# EAGLE design Kitty_PCB (EAGLE 9.2.2)
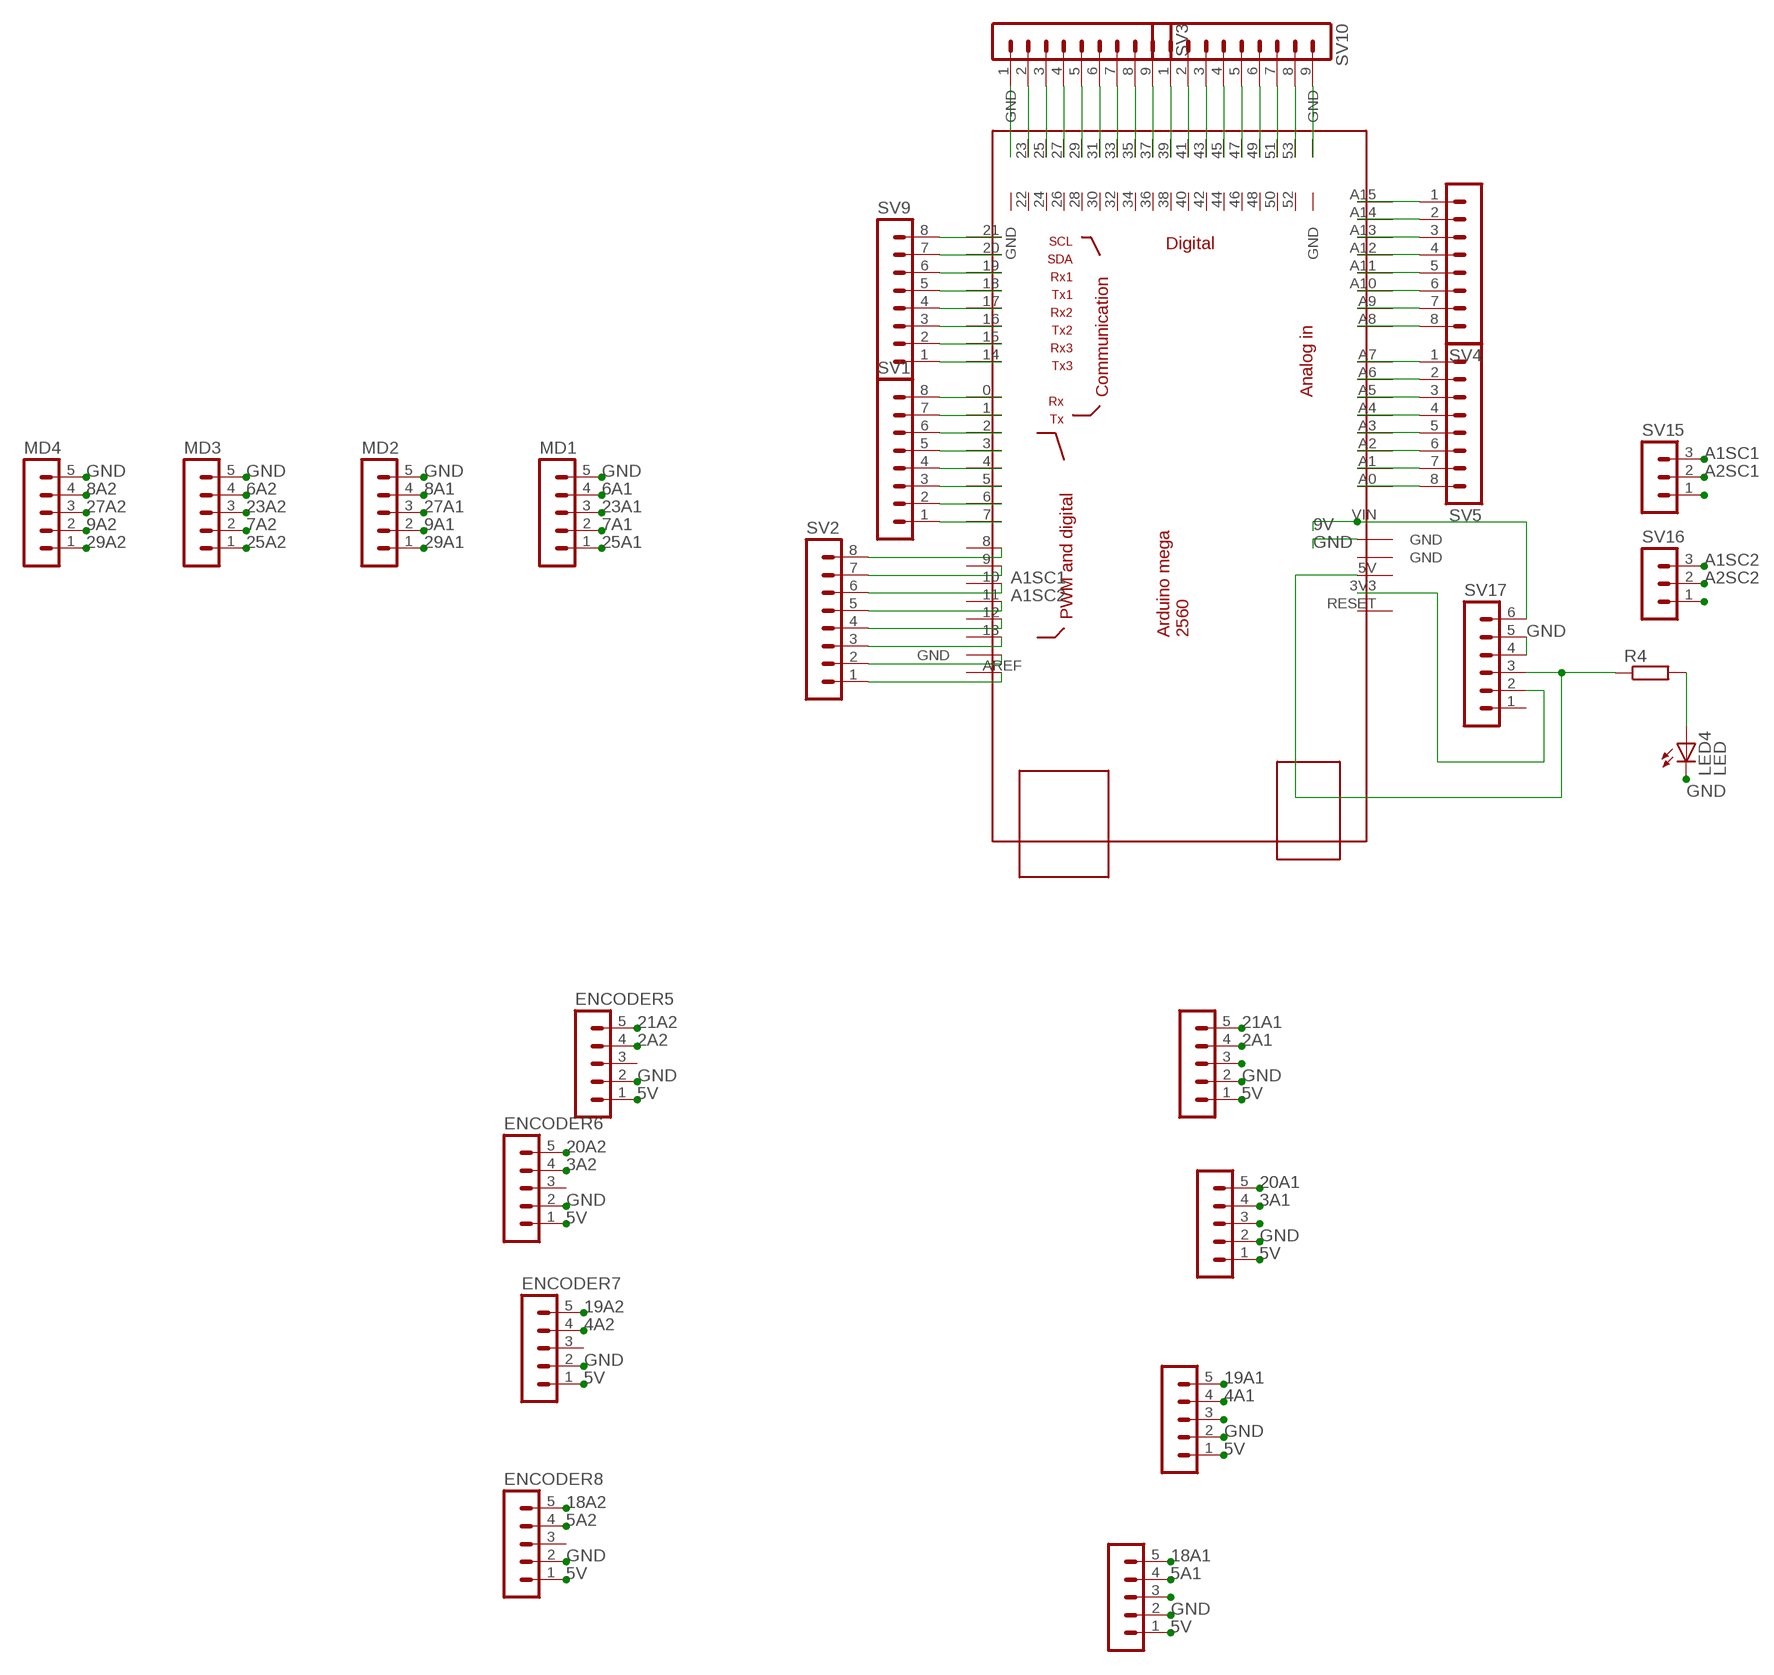
[diagram p0: schematic, sheet 1, part 1 of 2]
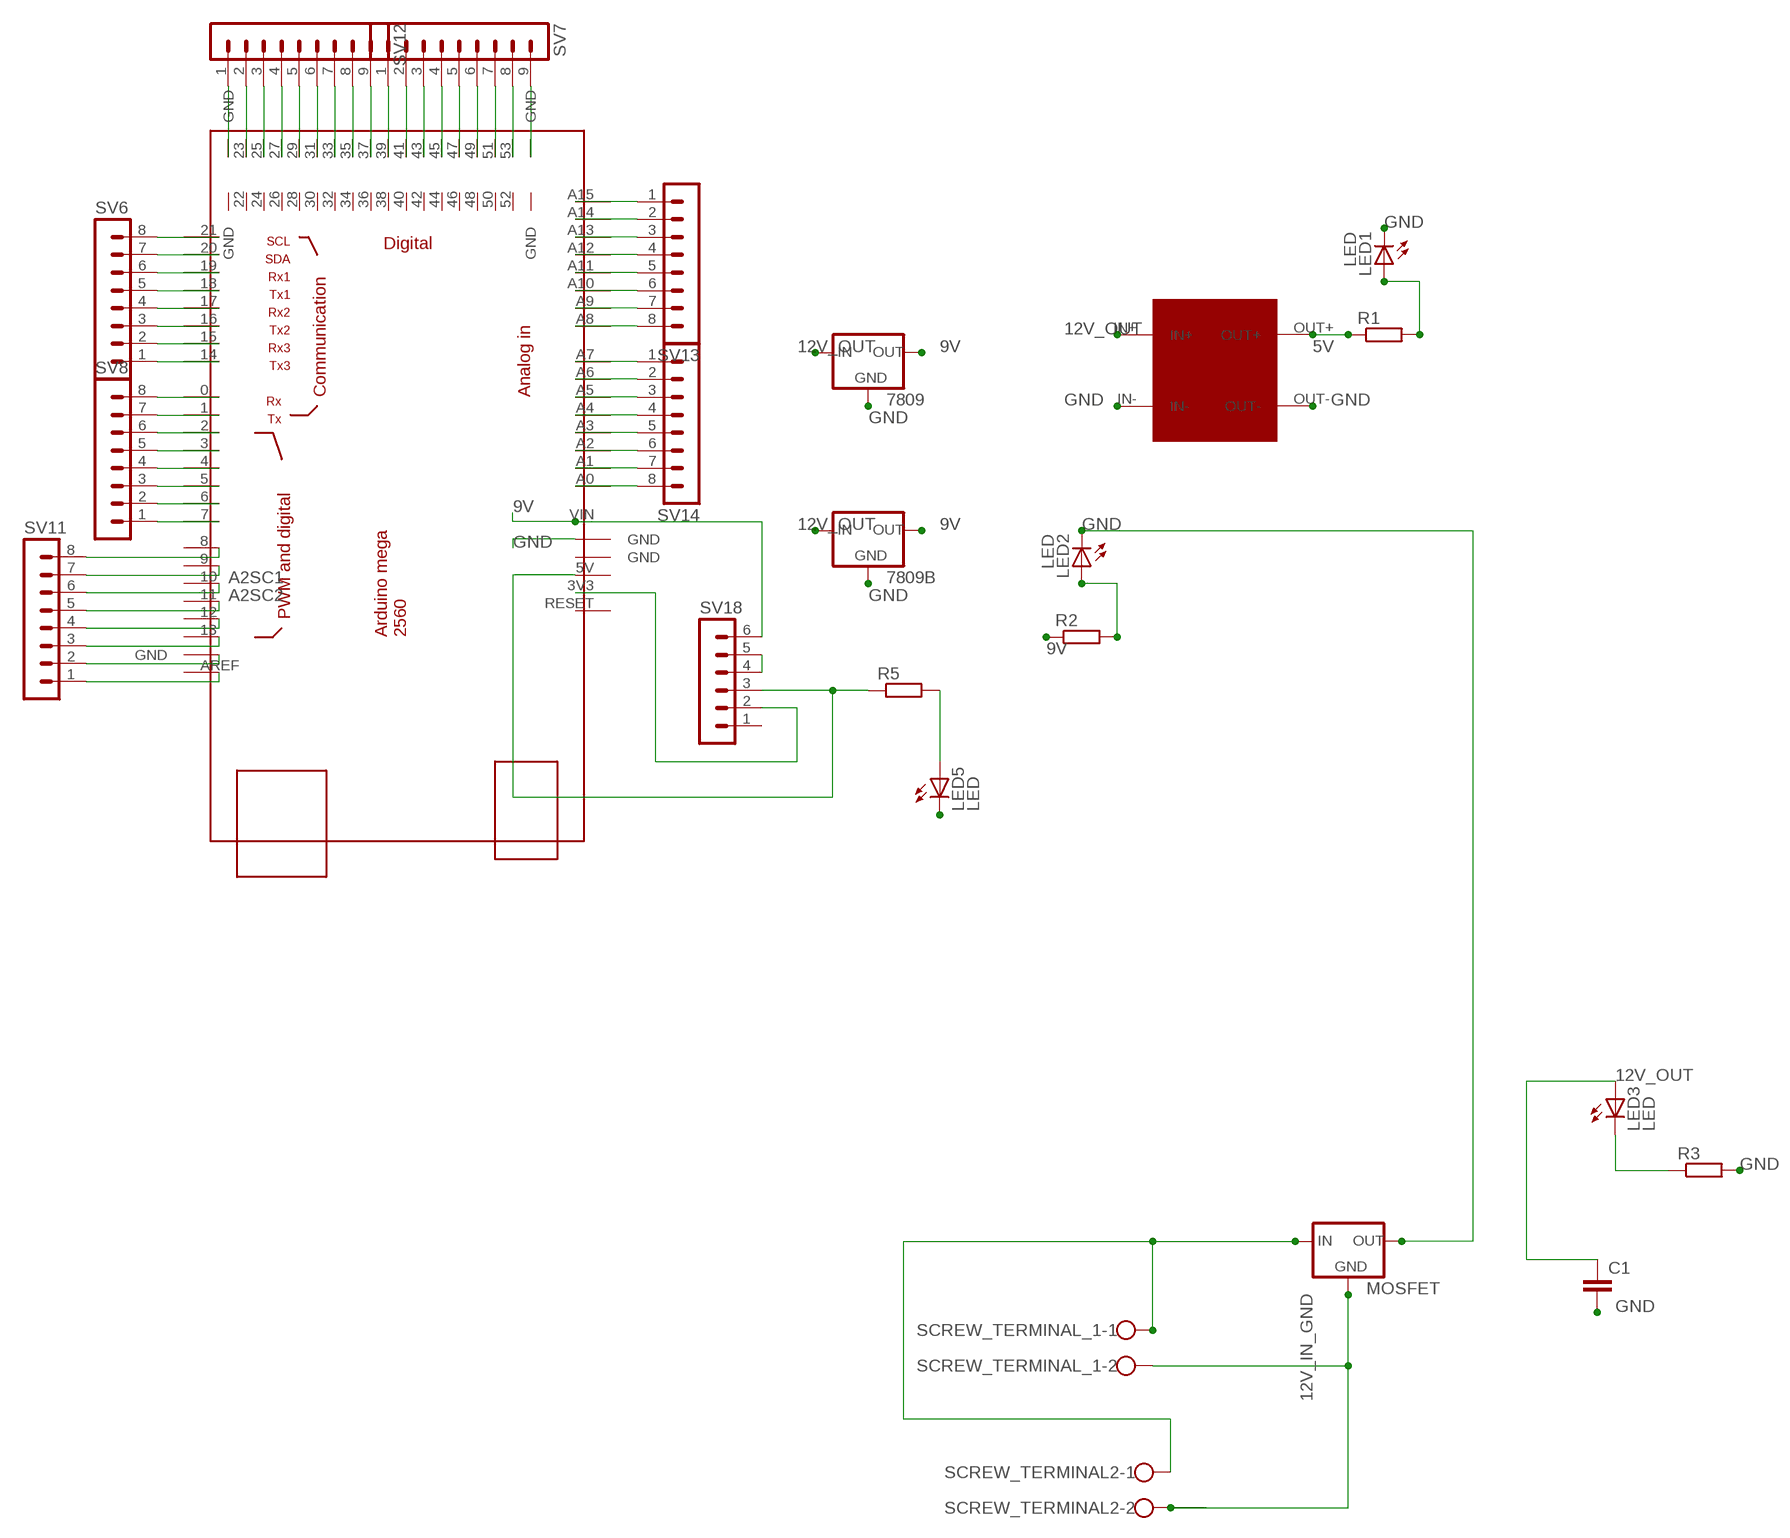
[diagram p1: schematic, sheet 1, part 2 of 2]

## Parts
7809  VOLTAGE_REGULATOR_78XXS  [78XXS]
7809B  VOLTAGE_REGULATOR_78XXS  [78XXS]
ARDUINO1  MEGA_DEVICE  [MEGABOX]
ARDUINO2  MEGA_DEVICE  [MEGABOX]
C1  CAPACITOR050-075X075  [C050-075X075]
ENCODER1  RELIMATE_05-1  [MA05-1]
ENCODER2  RELIMATE_05-1  [MA05-1]
ENCODER3  RELIMATE_05-1  [MA05-1]
ENCODER4  RELIMATE_05-1  [MA05-1]
ENCODER5  RELIMATE_05-1  [MA05-1]
ENCODER6  RELIMATE_05-1  [MA05-1]
ENCODER7  RELIMATE_05-1  [MA05-1]
ENCODER8  RELIMATE_05-1  [MA05-1]
LED1  LED  [LED3MM]
LED2  LED  [LED3MM]
LED3  LED  [LED3MM]
LED4  LED  [LED3MM]
LED5  LED  [LED3MM]
MD1  RELIMATE_05-1  [MA05-1]
MD2  RELIMATE_05-1  [MA05-1]
MD3  RELIMATE_05-1  [MA05-1]
MD4  RELIMATE_05-1  [MA05-1]
MOSFET  VOLTAGE_REGULATOR_78XXS  [78XXS]
R1  RESISTANCE0207/10  [0207/10]
R2  RESISTANCE0207/10  [0207/10]
R3  RESISTANCE0207/10  [0207/10]
R4  RESISTANCE0207/10  [0207/10]
R5  RESISTANCE0207/10  [0207/10]
SCREW_TERMINAL2  SCREW_TERMINAL_POWER  [POWER_CONNECTOR]
SCREW_TERMINAL_1  SCREW_TERMINAL_POWER  [POWER_CONNECTOR]
SV1  RELIMATE_08-1  [MA08-1]
SV2  RELIMATE_08-1  [MA08-1]
SV3  RELIMATE_09-1  [MA09-1]
SV4  RELIMATE_08-1  [MA08-1]
SV5  RELIMATE_08-1  [MA08-1]
SV6  RELIMATE_08-1  [MA08-1]
SV7  RELIMATE_09-1  [MA09-1]
SV8  RELIMATE_08-1  [MA08-1]
SV9  RELIMATE_08-1  [MA08-1]
SV10  RELIMATE_09-1  [MA09-1]
SV11  RELIMATE_08-1  [MA08-1]
SV12  RELIMATE_09-1  [MA09-1]
SV13  RELIMATE_08-1  [MA08-1]
SV14  RELIMATE_08-1  [MA08-1]
SV15  RELIMATE_03-1  [MA03-1]
SV16  RELIMATE_03-1  [MA03-1]
SV17  RELIMATE_06-1  [MA06-1]
SV18  RELIMATE_06-1  [MA06-1]
U$1  BUCK_CONVERTER  [BUCK_CONVERTER]

## Nets
0A1: ARDUINO1.0 SV1.8
0A2: ARDUINO2.0 SV8.8
1A1: ARDUINO1.1 SV1.7
1A2: ARDUINO2.1 SV8.7
2A1: ARDUINO1.2 ENCODER1.4 SV1.6
2A2: ARDUINO2.2 ENCODER5.4 SV8.6
3A1: ARDUINO1.3 ENCODER2.4 SV1.5
3A2: ARDUINO2.3 ENCODER6.4 SV8.5
4A1: ARDUINO1.4 ENCODER3.4 SV1.4
4A2: ARDUINO2.4 ENCODER7.4 SV8.4
5A1: ARDUINO1.5 ENCODER4.4 SV1.3
5A2: ARDUINO2.5 ENCODER8.4 SV8.3
5V: ENCODER1.1 ENCODER2.1 ENCODER3.1 ENCODER4.1 ENCODER5.1 ENCODER6.1 ENCODER7.1 ENCODER8.1 R1.1 U$1.OUT+
6A1: ARDUINO1.6 MD1.4 SV1.2
6A2: ARDUINO2.6 MD3.4 SV8.2
7A1: ARDUINO1.7 MD1.2 SV1.1
7A2: ARDUINO2.7 MD3.2 SV8.1
8A1: ARDUINO1.8 MD2.4 SV2.8
8A2: ARDUINO2.8 MD4.4 SV11.8
9A1: MD2.2
9A2: ARDUINO1.9 ARDUINO2.9 MD4.2 SV2.7 SV11.7
9V: 7809.OUT 7809B.OUT ARDUINO1.VIN ARDUINO2.VIN R2.1 SV17.6 SV18.6
12A1: ARDUINO1.12 SV2.4
12A2: ARDUINO2.12 SV11.4
12V_IN_GND: MOSFET.GND SCREW_TERMINAL2.2 SCREW_TERMINAL_1.2
12V_OUT: 7809.IN 7809B.IN C1.1 LED3.A MOSFET.IN SCREW_TERMINAL2.1 SCREW_TERMINAL_1.1 U$1.IN+
13A1: ARDUINO1.13 SV2.3
13A2: ARDUINO2.13 SV11.3
14A1: ARDUINO1.14 SV9.1
14A2: ARDUINO2.14 SV6.1
15A1: ARDUINO1.15 SV9.2
15A2: ARDUINO2.15 SV6.2
16A1: ARDUINO1.16 SV9.3
16A2: ARDUINO2.16 SV6.3
17A1: ARDUINO1.17 SV9.4
17A2: ARDUINO2.17 SV6.4
18A1: ARDUINO1.18 ENCODER4.5 SV9.5
18A2: ARDUINO2.18 ENCODER8.5 SV6.5
19A1: ARDUINO1.19 ENCODER3.5 SV9.6
19A2: ARDUINO2.19 ENCODER7.5 SV6.6
20A1: ARDUINO1.20 ENCODER2.5 SV9.7
20A2: ARDUINO2.20 ENCODER6.5 SV6.7
21A1: ARDUINO1.21 ENCODER1.5 SV9.8
21A2: ARDUINO2.21 ENCODER5.5 SV6.8
23A1: ARDUINO1.23 MD1.3 SV3.2
23A2: ARDUINO2.23 MD3.3 SV12.2
25A1: ARDUINO1.25 MD1.1 SV3.3
25A2: ARDUINO2.25 MD3.1 SV12.3
27A1: ARDUINO1.27 MD2.3 SV3.4
27A2: ARDUINO2.27 MD4.3 SV12.4
29A1: ARDUINO1.29 MD2.1 SV3.5
29A2: ARDUINO2.29 MD4.1 SV12.5
31A1: ARDUINO1.31 SV3.6
31A2: ARDUINO2.31 SV12.6
33A1: ARDUINO1.33 SV3.7
33A2: ARDUINO2.33 SV12.7
35A1: ARDUINO1.35 SV3.8
35A2: ARDUINO2.35 SV12.8
37A1: ARDUINO1.37 SV3.9
37A2: ARDUINO2.37 SV12.9
A1SC1: ARDUINO1.10 SV2.6 SV15.3
A1SC2: ARDUINO1.11 SV2.5 SV16.3
A2SC1: ARDUINO2.10 SV11.6 SV15.2
A2SC2: ARDUINO2.11 SV11.5 SV16.2
GND: 7809.GND 7809B.GND ARDUINO1.GND@3(GND) ARDUINO2.GND@3(GND) C1.2 ENCODER1.2 ENCODER2.2 ENCODER3.2 ENCODER4.2 ENCODER5.2 ENCODER6.2 ENCODER7.2 ENCODER8.2 LED1.K(C) LED2.K(C) LED4.K(C) LED5.A LED5.K(C) MD1.5 MD2.5 MD3.5 MD4.5 MOSFET.OUT R3.2 R5.2 SV17.4 SV17.5 U$1.IN- U$1.OUT-
N$1: ARDUINO1.3V3 SV17.2
N$2: ARDUINO1.5V R4.1 SV17.3
N$3: LED1.A R1.2
N$4: SV18.4 SV18.5
N$5: ARDUINO2.3V3 SV18.2
N$6: ARDUINO2.5V R5.1 SV18.3
N$7: LED4.A R4.2
N$19: LED2.A R2.2
N$20: ARDUINO1.GND@5(GND) SV3.1
N$24: ARDUINO1.GND@1(GND) SV2.2
N$25: ARDUINO1.AREF SV2.1
N$26: ARDUINO1.A15 SV4.1
N$27: ARDUINO1.A14 SV4.2
N$28: ARDUINO1.A13 SV4.3
N$29: ARDUINO1.A12 SV4.4
N$30: ARDUINO1.A11 SV4.5
N$31: ARDUINO1.A10 SV4.6
N$32: ARDUINO1.A9 SV4.7
N$33: ARDUINO1.A8 SV4.8
N$34: ARDUINO1.A7 SV5.1
N$35: ARDUINO1.A6 SV5.2
N$36: ARDUINO1.A5 SV5.3
N$37: ARDUINO1.A4 SV5.4
N$38: ARDUINO1.A3 SV5.5
N$39: ARDUINO1.A2 SV5.6
N$40: ARDUINO1.A1 SV5.7
N$41: ARDUINO1.A0 SV5.8
N$59: SV15.1
N$64: ARDUINO2.GND@1(GND) SV11.2
N$65: ARDUINO2.AREF SV11.1
N$66: ARDUINO2.A15 SV13.1
N$67: ARDUINO2.A14 SV13.2
N$68: ARDUINO2.A13 SV13.3
N$69: ARDUINO2.A12 SV13.4
N$70: ARDUINO2.A11 SV13.5
N$71: ARDUINO2.A10 SV13.6
N$72: ARDUINO2.A9 SV13.7
N$73: ARDUINO2.A8 SV13.8
N$74: ARDUINO2.A7 SV14.1
N$75: ARDUINO2.A6 SV14.2
N$76: ARDUINO2.A5 SV14.3
N$77: ARDUINO2.A4 SV14.4
N$78: ARDUINO2.A3 SV14.5
N$79: ARDUINO2.A2 SV14.6
N$80: ARDUINO2.A1 SV14.7
N$81: ARDUINO2.A0 SV14.8
N$82: SV16.1
N$88: ARDUINO1.39 SV10.1
N$89: ARDUINO1.41 SV10.2
N$90: ARDUINO1.43 SV10.3
N$91: ARDUINO1.45 SV10.4
N$92: ARDUINO1.47 SV10.5
N$93: ARDUINO1.49 SV10.6
N$94: ARDUINO1.51 SV10.7
N$95: ARDUINO1.53 SV10.8
N$96: ARDUINO1.GND@7(GND) SV10.9
N$97: ARDUINO2.GND@5(GND) SV12.1
N$106: ARDUINO2.39 SV7.1
N$107: ARDUINO2.41 SV7.2
N$108: ARDUINO2.43 SV7.3
N$109: ARDUINO2.45 SV7.4
N$110: ARDUINO2.47 SV7.5
N$111: ARDUINO2.49 SV7.6
N$112: ARDUINO2.51 SV7.7
N$113: ARDUINO2.53 SV7.8
N$114: ARDUINO2.GND@7(GND) SV7.9
N$115: LED3.K(C) R3.1
N$118: ENCODER1.3
N$122: ENCODER2.3
N$126: ENCODER4.3
N$130: ENCODER3.3
Unconnected: ARDUINO1.22 ARDUINO1.24 ARDUINO1.26 ARDUINO1.28 ARDUINO1.30 ARDUINO1.32 ARDUINO1.34 ARDUINO1.36 ARDUINO1.38 ARDUINO1.40 ARDUINO1.42 ARDUINO1.44 ARDUINO1.46 ARDUINO1.48 ARDUINO1.50 ARDUINO1.52 ARDUINO1.GND@2(GND) ARDUINO1.GND@4(GND) ARDUINO1.GND@6(GND) ARDUINO1.RESET ARDUINO2.22 ARDUINO2.24 ARDUINO2.26 ARDUINO2.28 ARDUINO2.30 ARDUINO2.32 ARDUINO2.34 ARDUINO2.36 ARDUINO2.38 ARDUINO2.40 ARDUINO2.42 ARDUINO2.44 ARDUINO2.46 ARDUINO2.48 ARDUINO2.50 ARDUINO2.52 ARDUINO2.GND@2(GND) ARDUINO2.GND@4(GND) ARDUINO2.GND@6(GND) ARDUINO2.RESET ENCODER5.3 ENCODER6.3 ENCODER7.3 ENCODER8.3 SV17.1 SV18.1

## Library data of the parts
7809 7809B MOSFET = robocon:VOLTAGE_REGULATOR_78XXS: VOLTAGE REGULATOR
ARDUINO1 ARDUINO2 = ArduinoMegaSymbol:MEGA_DEVICE: mega card as device
C1 = robocon:CAPACITOR: CAPACITOR, European symbol
ENCODER1-ENCODER8 MD1-MD4 = robocon:RELIMATE_05-1: PIN HEADER; OC_FARNELL: unknown; OC_NEWARK: unknown
LED1-LED5 = robocon:LED: Low Current (2mA) LED 3 mm Tinted Diffused Package color RED Source: Data sheet <http://www.farnell.com/datasheets/391100.pdf>; MF: VISHAY SEMICONDUCTOR; OC_FARNELL: 1612437
R1-R5 = robocon:RESISTANCE: RESISTOR, European symbol
SCREW_TERMINAL2 SCREW_TERMINAL_1 = robocon:SCREW_TERMINAL_POWER: WAGO SCREW CLAMP; MPN: 237-102; OC_FARNELL: unknown; OC_NEWARK: 70K9898
SV1 SV2 SV4-SV6 SV8 SV9 SV11 SV13 SV14 = robocon:RELIMATE_08-1: PIN HEADER; OC_FARNELL: unknown; OC_NEWARK: unknown
SV3 SV7 SV10 SV12 = robocon:RELIMATE_09-1: PIN HEADER; OC_FARNELL: unknown; OC_NEWARK: unknown
SV15 SV16 = robocon:RELIMATE_03-1: PIN HEADER; OC_FARNELL: unknown; OC_NEWARK: unknown
SV17 SV18 = robocon:RELIMATE_06-1: PIN HEADER; OC_FARNELL: unknown; OC_NEWARK: unknown
U$1 = robocon:BUCK_CONVERTER: LM2596-DC-DC-buck-converter-adjustable-3V-40V-step-down-module-power-supply LM

## Board
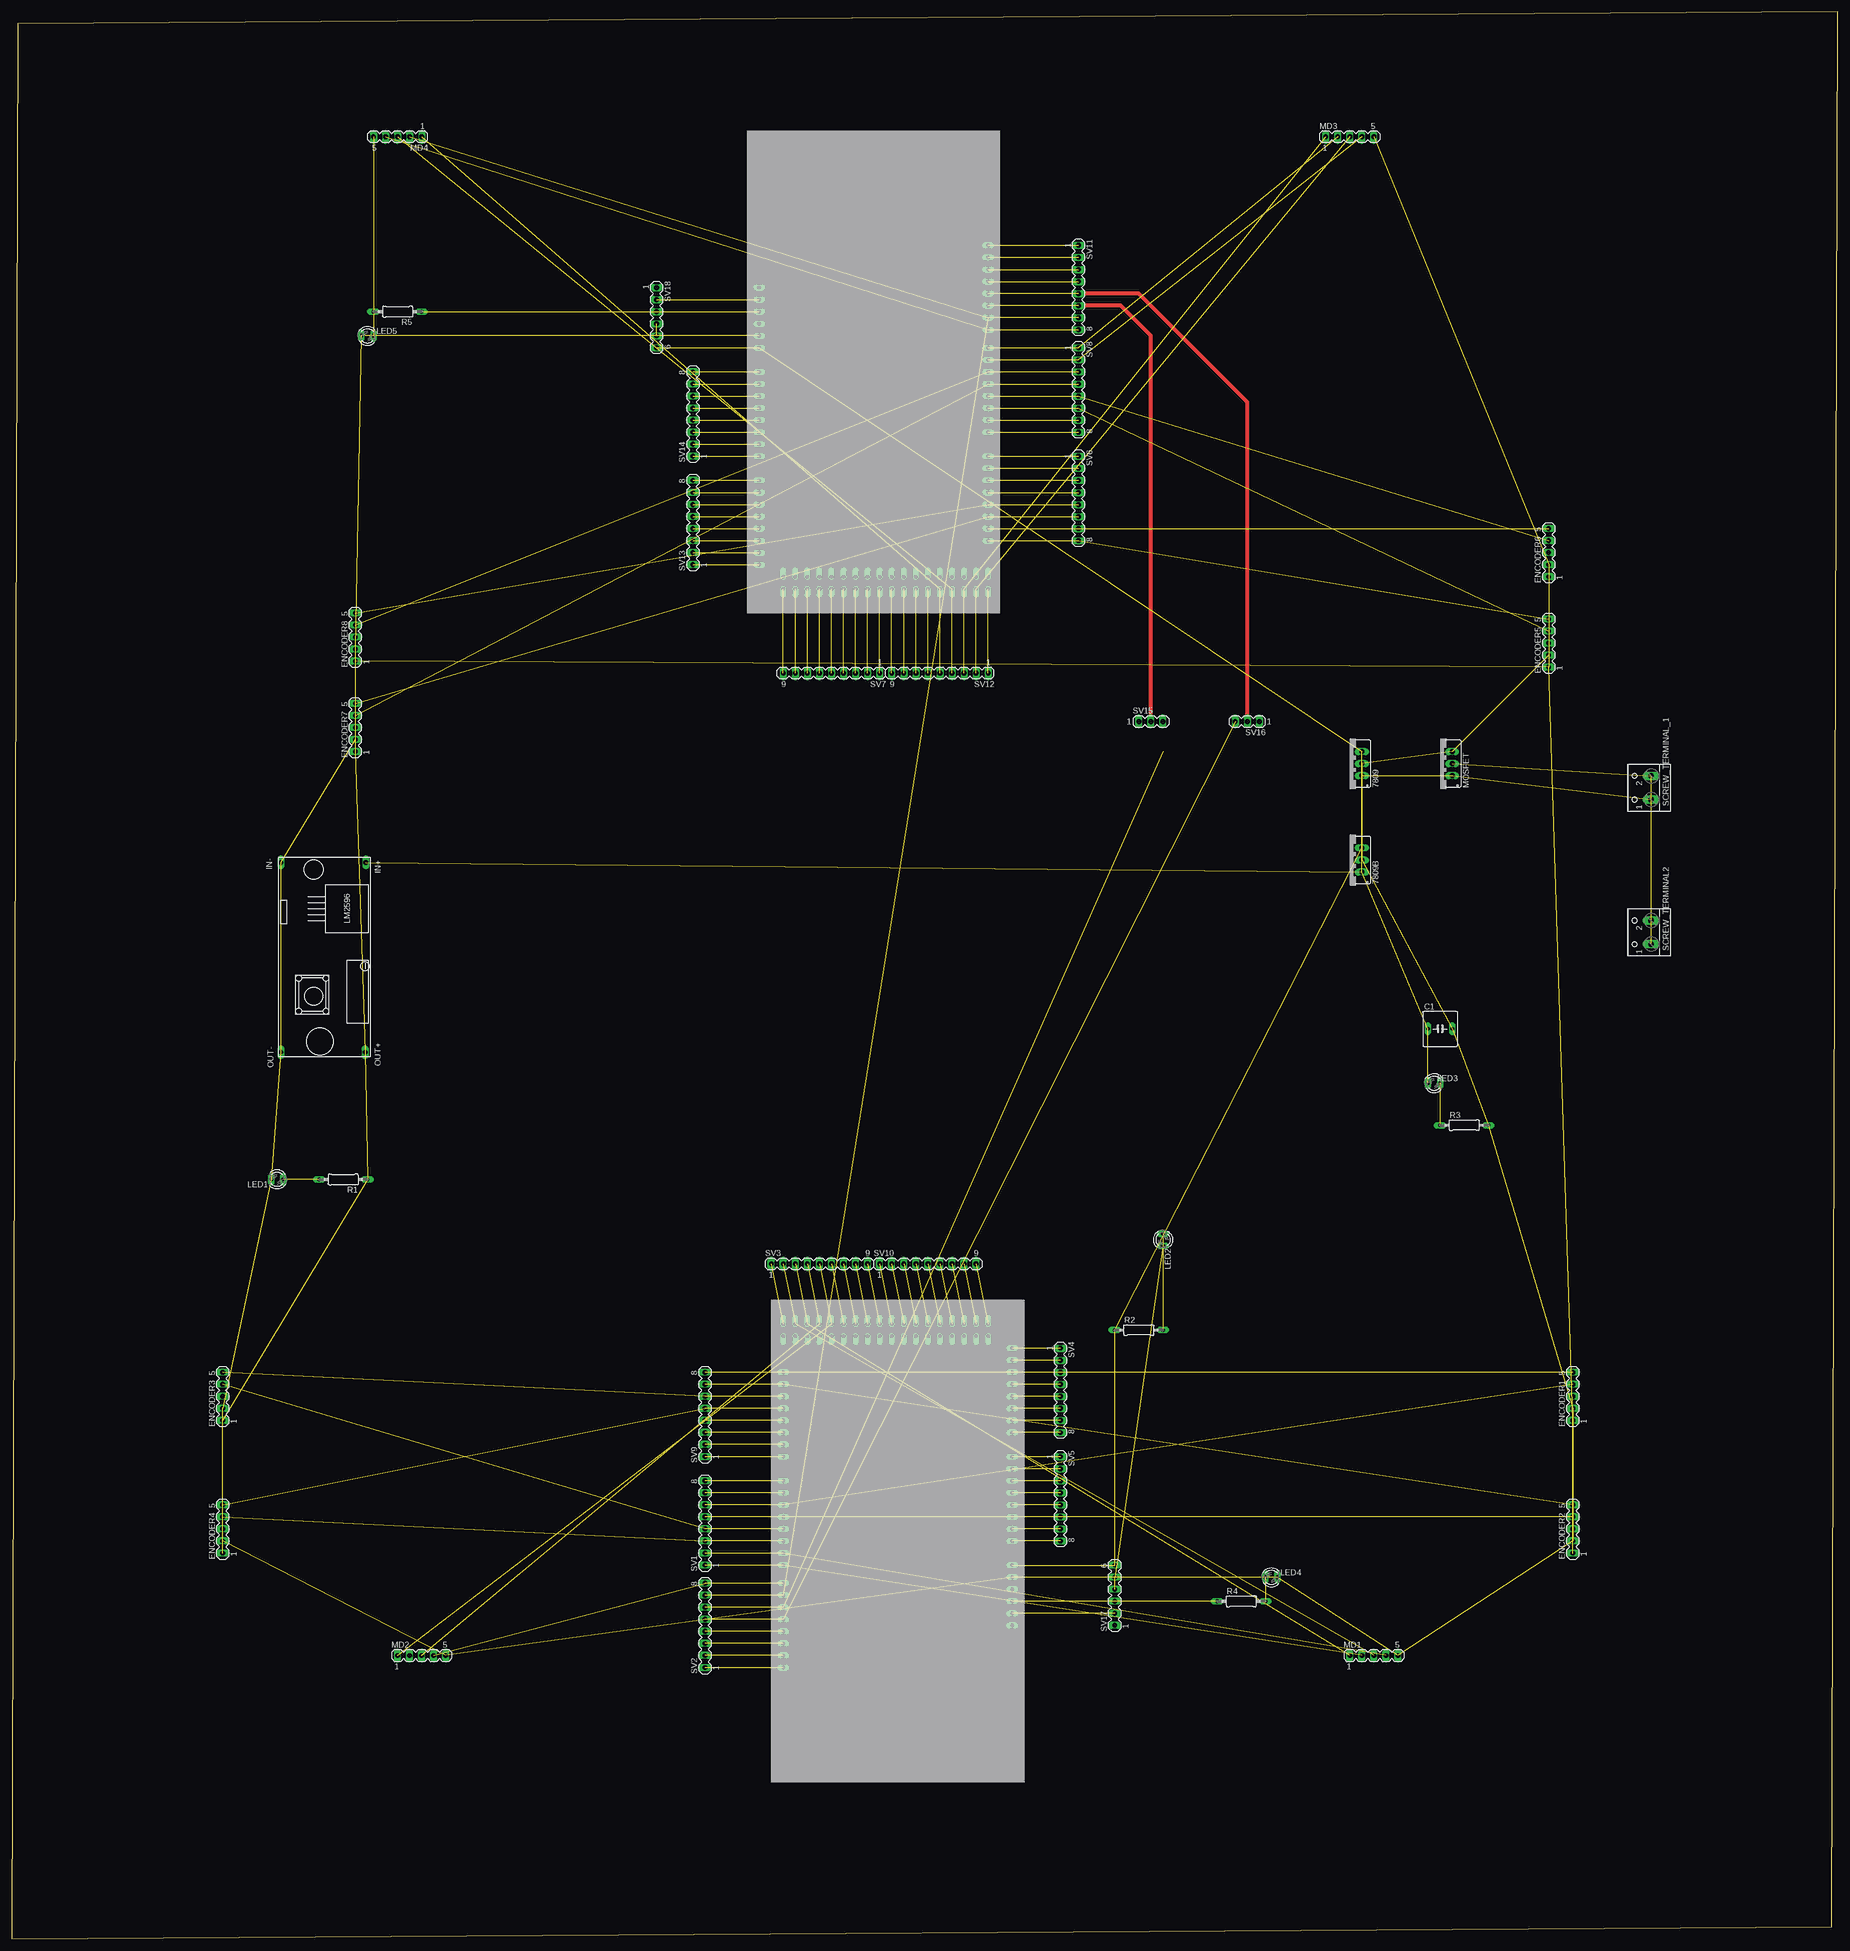
[diagram p2: board, top side]
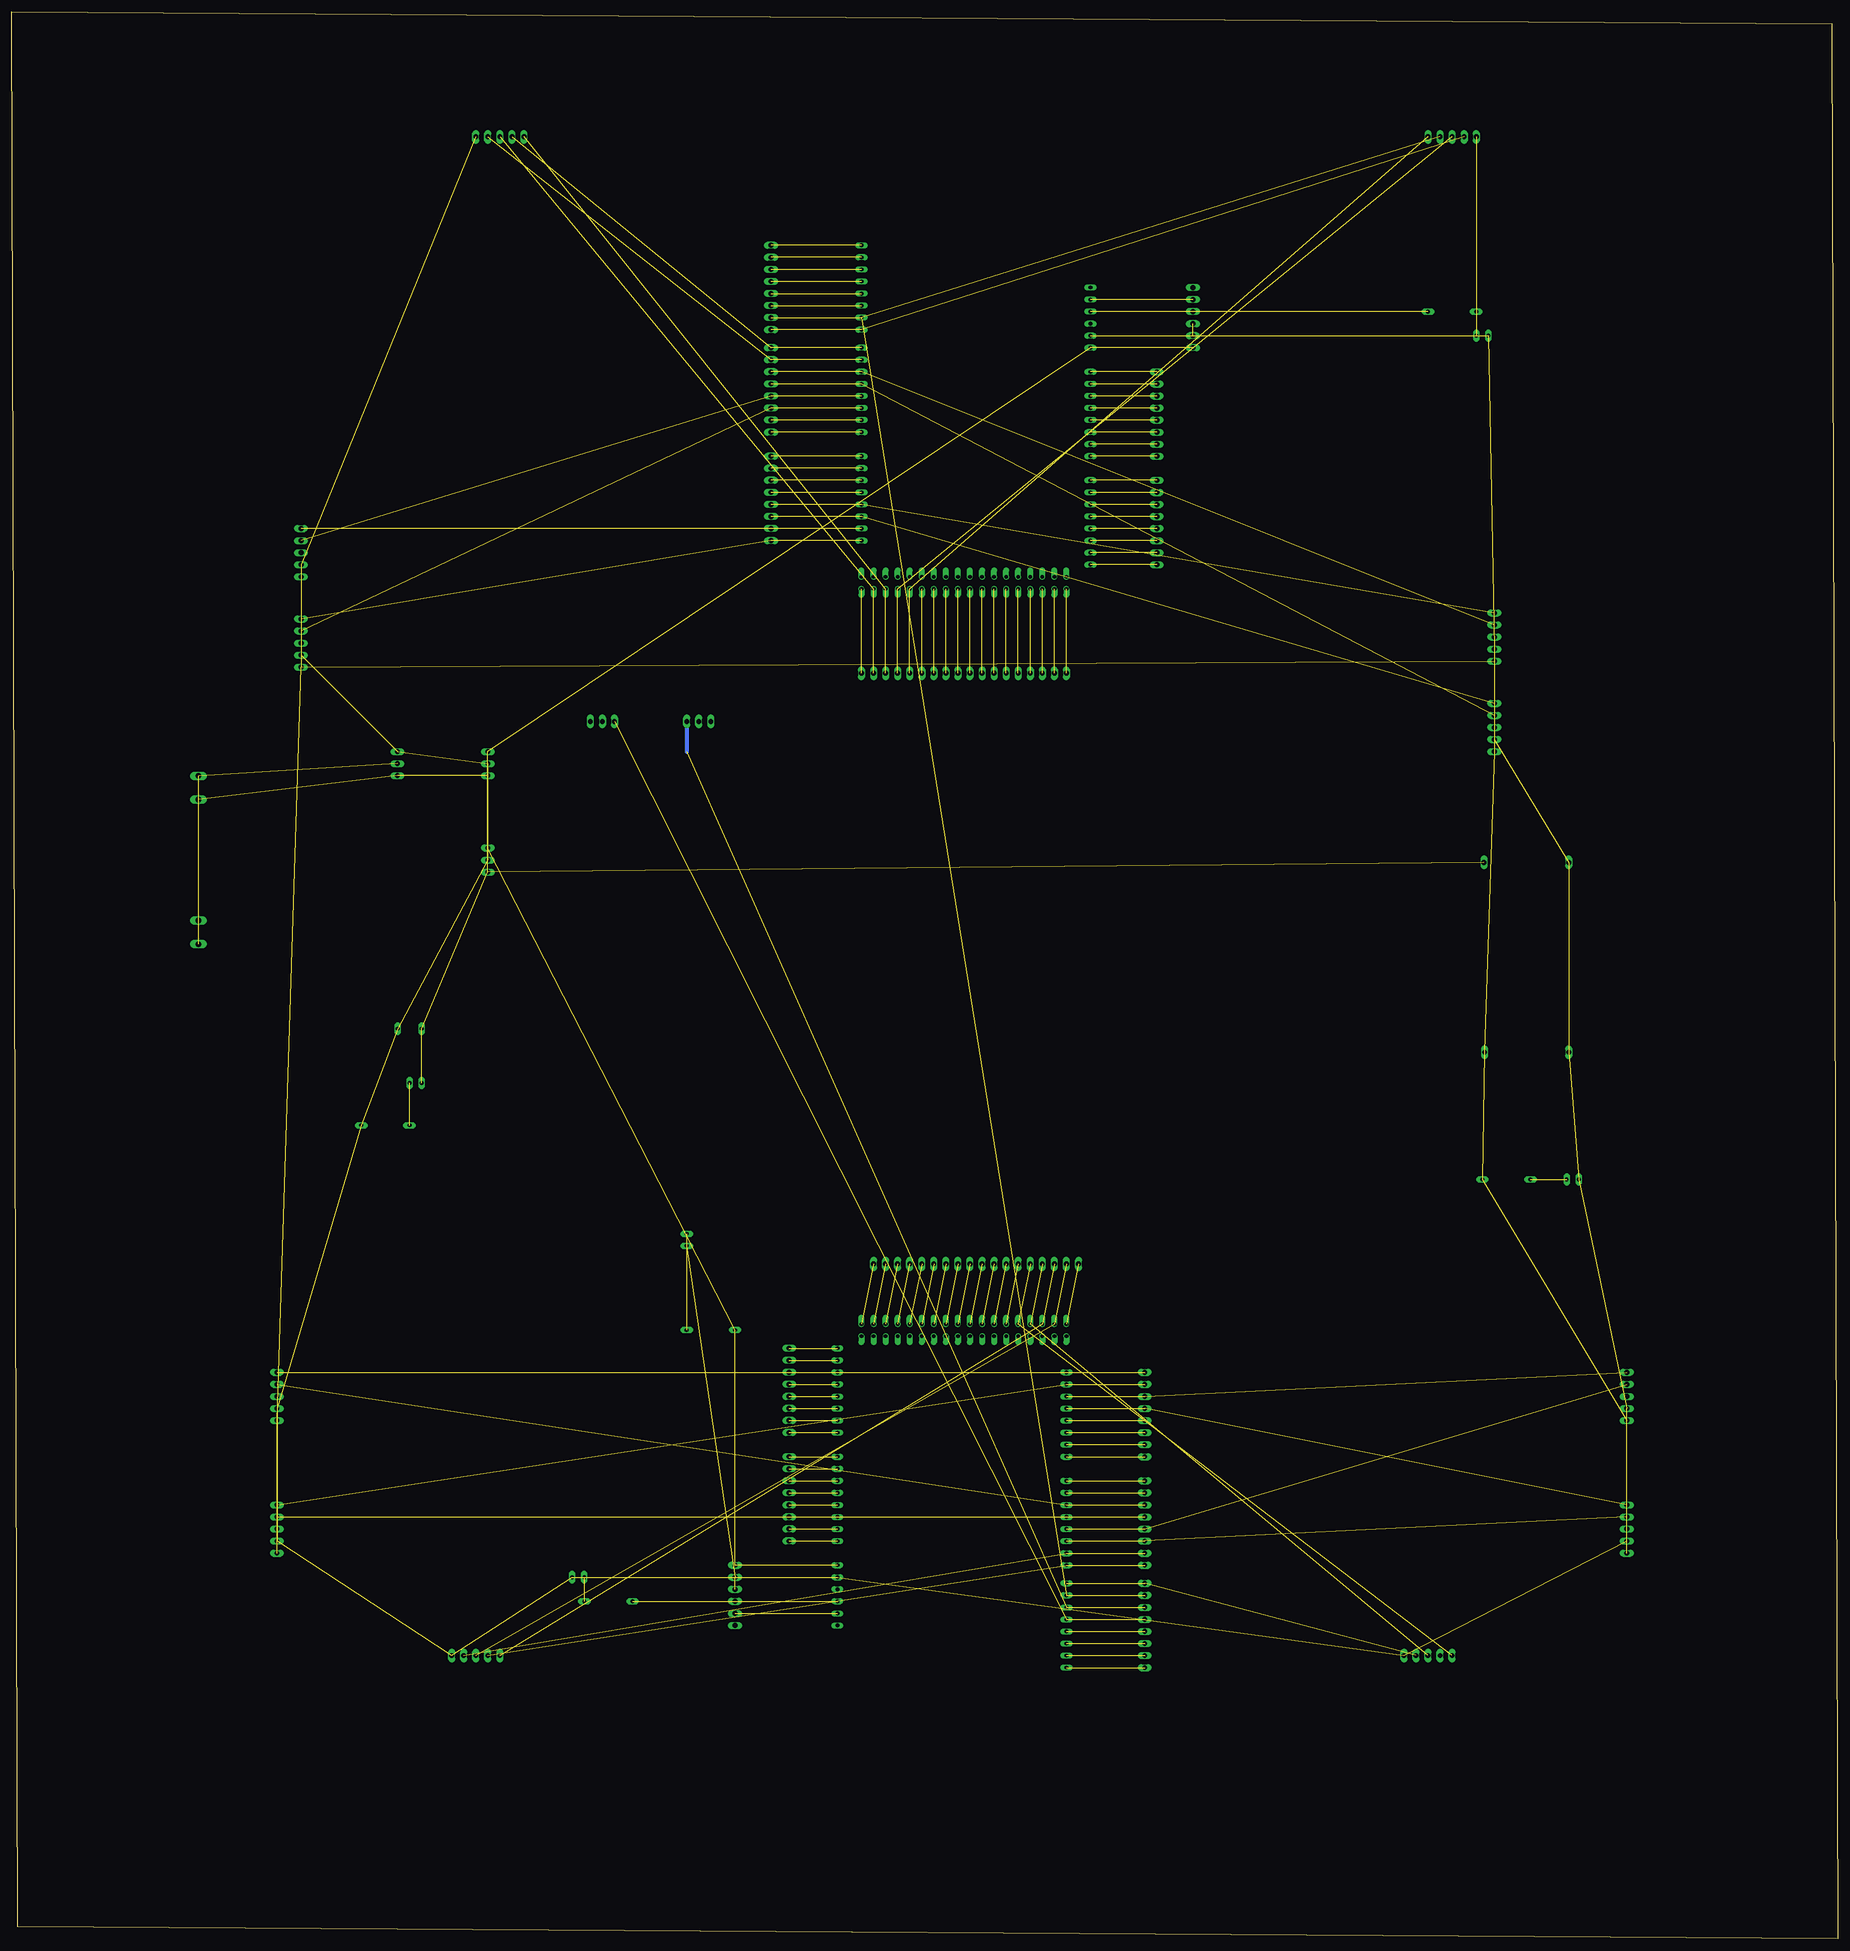
[diagram p3: board, bottom side, seen from below]

Size 384.79 x 406.07 mm. Coordinates in mm from the lower left corner, seen from the top.
Outline: 0,0 383.52,2.54 384.79,406.07 1.27,403.53 0,0
Copper layers (1*16): Top 0.035mm / dielectric 1.5mm / Bottom 0.035mm
Design rules "default": minimum track width 6mil, minimum drill 0.35mm, track to track 6mil, track to pad 6mil, pad to pad 6mil, via to via 6mil, smd to smd 6mil, copper to edge 40mil, drill to drill 6mil, minimum pad ring 10mil, minimum via ring 8mil, stop-mask expansion 4mil, vias tented up to drill 0mil, thermal gap 10mil

### Footprints (pad centres in the part's own frame; a part is rotated, then mirrored left to right if it is on the bottom)
78XXS = drill 1.016 long: GND 0,-2.54; IN -2.54,-2.54; OUT 2.54,-2.54
MEGABOX = drill 0.8 long: 0 12.7,24.13; 1 10.16,24.13; 2 7.62,24.13; 3 5.08,24.13; 3V3 -15.24,-24.13; 4 2.54,24.13; 5 0,24.13; 5V -12.7,-24.13; 6 -2.54,24.13; 7 -5.08,24.13; 8 -8.89,24.13; 9 -11.43,24.13; 10 -13.97,24.13; 11 -16.51,24.13; 12 -19.05,24.13; 13 -21.59,24.13; 14 17.78,24.13; 15 20.32,24.13; 16 22.86,24.13; 17 25.4,24.13; 18 27.94,24.13; 19 30.48,24.13; 20 33.02,24.13; 21 35.56,24.13; A0 0,-24.13; A1 2.54,-24.13; A2 5.08,-24.13; A3 7.62,-24.13; A4 10.16,-24.13; A5 12.7,-24.13; A6 15.24,-24.13; A7 17.78,-24.13; A8 22.86,-24.13; A9 25.4,-24.13; A10 27.94,-24.13; A11 30.48,-24.13; A12 33.02,-24.13; A13 35.56,-24.13; A14 38.1,-24.13; A15 40.64,-24.13; AREF -26.67,24.13; GND@1 -24.13,24.13; GND@2 -10.16,-24.13; GND@3 -7.62,-24.13; RESET -17.78,-24.13; VIN -5.08,-24.13 | drill 0.8 offset: 22 43.18,21.59; 23 45.72,21.59; 24 43.18,19.05; 25 45.72,19.05; 26 43.18,16.51; 27 45.72,16.51; 28 43.18,13.97; 29 45.72,13.97; 30 43.18,11.43; 31 45.72,11.43; 32 43.18,8.89; 33 45.72,8.89; 34 43.18,6.35; 35 45.72,6.35; 36 43.18,3.81; 37 45.72,3.81; 38 43.18,1.27; 39 45.72,1.27; 40 43.18,-1.27; 41 45.72,-1.27; 42 43.18,-3.81; 43 45.72,-3.81; 44 43.18,-6.35; 45 45.72,-6.35; 46 43.18,-8.89; 47 45.72,-8.89; 48 43.18,-11.43; 49 45.72,-11.43; 50 43.18,-13.97; 51 45.72,-13.97; 52 43.18,-16.51; 53 45.72,-16.51; GND@4 43.18,24.13; GND@5 45.72,24.13; GND@6 43.18,-19.05; GND@7 45.72,-19.05
C050-075X075 = drill 0.813 long: 1 -2.54,0; 2 2.54,0
MA05-1 = drill 1.016 long: 1 -5.08,0; 2 -2.54,0; 3 0,0; 4 2.54,0; 5 5.08,0
LED3MM = drill 0.813 long: A -1.27,0; K 1.27,0
0207/10 = drill 0.813 long: 1 -5.08,0; 2 5.08,0
POWER_CONNECTOR = drill 1.194 long: 1 -2.5,-1.27; 2 2.5,-1.27
MA08-1 = drill 1.016 long: 1 -8.89,0; 2 -6.35,0; 3 -3.81,0; 4 -1.27,0; 5 1.27,0; 6 3.81,0; 7 6.35,0; 8 8.89,0
MA09-1 = drill 1.016 long: 1 -10.16,0; 2 -7.62,0; 3 -5.08,0; 4 -2.54,0; 5 0,0; 6 2.54,0; 7 5.08,0; 8 7.62,0; 9 10.16,0
MA03-1 = drill 1.016 long: 1 -2.54,0; 2 0,0; 3 2.54,0
MA06-1 = drill 1.016 long: 1 -6.35,0; 2 -3.81,0; 3 -1.27,0; 4 1.27,0; 5 3.81,0; 6 6.35,0
BUCK_CONVERTER = drill 1.016 long: IN+ -18.558,7.255; IN- -18.558,-10.618; OUT+ 21.442,7.128; OUT- 21.442,-10.618

### Placement (x,y rotation side)
7809  281.94,247.65 90 top
7809B  281.94,227.33 90 top
ARDUINO1  186.69,83.82 90 top
ARDUINO2  181.61,330.2 270 top
C1  300.99,191.77 0 top
ENCODER1  328.93,114.3 90 top
ENCODER2  328.93,86.36 90 top
ENCODER3  44.45,114.3 90 top
ENCODER4  44.45,86.36 90 top
ENCODER5  323.85,273.05 90 top
ENCODER6  323.85,292.1 90 top
ENCODER7  72.39,255.27 90 top
ENCODER8  72.39,274.32 90 top
LED1  55.88,160.02 180 top
LED2  242.57,147.32 270 top
LED3  299.72,180.34 0 top
LED4  265.43,76.2 0 top
LED5  74.93,337.82 0 top
MD1  287.02,59.69 0 top
MD2  86.36,59.69 0 top
MD3  281.94,379.73 0 top
MD4  81.28,379.73 180 top
MOSFET  300.99,247.65 90 top
R1  69.85,160.02 180 top
R2  237.49,128.27 0 top
R3  306.07,171.45 0 top
R4  259.08,71.12 0 top
R5  81.28,342.9 180 top
SCREW_TERMINAL2  344.17,212.09 90 top
SCREW_TERMINAL_1  344.17,242.57 90 top
SV1  146.05,87.63 90 top
SV2  146.05,66.04 90 top
SV3  170.18,142.24 0 top
SV4  220.98,115.57 270 top
SV5  220.98,92.71 270 top
SV6  224.79,303.53 270 top
SV7  172.72,266.7 180 top
SV8  224.79,326.39 270 top
SV9  146.05,110.49 90 top
SV10  193.04,142.24 0 top
SV11  224.79,347.98 270 top
SV12  195.58,266.7 180 top
SV13  143.51,298.45 90 top
SV14  143.51,321.31 90 top
SV15  240.03,256.54 0 top
SV16  260.35,256.54 180 top
SV17  232.41,72.39 90 top
SV18  135.89,341.63 270 top
U$1  67.31,208.28 270 top

### Tracks (layer width: path | path; a pad name or v marks a point on that pad's centre or on a via)
0A1  (1 unrouted)
0A2  (1 unrouted)
1A1  (1 unrouted)
1A2  (1 unrouted)
2A1  (2 unrouted)
2A2  (2 unrouted)
3A1  (2 unrouted)
3A2  (2 unrouted)
4A1  (2 unrouted)
4A2  (2 unrouted)
5A1  (2 unrouted)
5A2  (2 unrouted)
5V  (9 unrouted)
6A1  (2 unrouted)
6A2  (2 unrouted)
7A1  (2 unrouted)
7A2  (2 unrouted)
8A1  (2 unrouted)
8A2  (2 unrouted)
9A2  (4 unrouted)
9V  (6 unrouted)
12A1  (1 unrouted)
12A2  (1 unrouted)
12V_IN_GND  (2 unrouted)
12V_OUT  (7 unrouted)
13A1  (1 unrouted)
13A2  (1 unrouted)
14A1  (1 unrouted)
14A2  (1 unrouted)
15A1  (1 unrouted)
15A2  (1 unrouted)
16A1  (1 unrouted)
16A2  (1 unrouted)
17A1  (1 unrouted)
17A2  (1 unrouted)
18A1  (2 unrouted)
18A2  (2 unrouted)
19A1  (2 unrouted)
19A2  (2 unrouted)
20A1  (2 unrouted)
20A2  (2 unrouted)
21A1  (2 unrouted)
21A2  (2 unrouted)
23A1  (2 unrouted)
23A2  (2 unrouted)
25A1  (2 unrouted)
25A2  (2 unrouted)
27A1  (2 unrouted)
27A2  (2 unrouted)
29A1  (2 unrouted)
29A2  (2 unrouted)
31A1  (1 unrouted)
31A2  (1 unrouted)
33A1  (1 unrouted)
33A2  (1 unrouted)
35A1  (1 unrouted)
35A2  (1 unrouted)
37A1  (1 unrouted)
37A2  (1 unrouted)
A1SC1  (2 unrouted)
  Bottom 0.813: SV15.3 242.57,250.19 | 242.57,250.19
A1SC2  (2 unrouted)
A2SC1  (1 unrouted)
  Top 0.813: SV15.2 240.03,337.82 233.68,344.17 SV11.6
A2SC2  (1 unrouted)
  Top 0.813: SV16.2 260.35,323.85 237.49,346.71 SV11.5
GND  (28 unrouted)
N$1  (1 unrouted)
N$2  (2 unrouted)
N$3  (1 unrouted)
N$4  (1 unrouted)
N$5  (1 unrouted)
N$6  (2 unrouted)
N$7  (1 unrouted)
N$19  (1 unrouted)
N$20  (1 unrouted)
N$24  (1 unrouted)
N$25  (1 unrouted)
N$26  (1 unrouted)
N$27  (1 unrouted)
N$28  (1 unrouted)
N$29  (1 unrouted)
N$30  (1 unrouted)
N$31  (1 unrouted)
N$32  (1 unrouted)
N$33  (1 unrouted)
N$34  (1 unrouted)
N$35  (1 unrouted)
N$36  (1 unrouted)
N$37  (1 unrouted)
N$38  (1 unrouted)
N$39  (1 unrouted)
N$40  (1 unrouted)
N$41  (1 unrouted)
N$64  (1 unrouted)
N$65  (1 unrouted)
N$66  (1 unrouted)
N$67  (1 unrouted)
N$68  (1 unrouted)
N$69  (1 unrouted)
N$70  (1 unrouted)
N$71  (1 unrouted)
N$72  (1 unrouted)
N$73  (1 unrouted)
N$74  (1 unrouted)
N$75  (1 unrouted)
N$76  (1 unrouted)
N$77  (1 unrouted)
N$78  (1 unrouted)
N$79  (1 unrouted)
N$80  (1 unrouted)
N$81  (1 unrouted)
N$88  (1 unrouted)
N$89  (1 unrouted)
N$90  (1 unrouted)
N$91  (1 unrouted)
N$92  (1 unrouted)
N$93  (1 unrouted)
N$94  (1 unrouted)
N$95  (1 unrouted)
N$96  (1 unrouted)
N$97  (1 unrouted)
N$106  (1 unrouted)
N$107  (1 unrouted)
N$108  (1 unrouted)
N$109  (1 unrouted)
N$110  (1 unrouted)
N$111  (1 unrouted)
N$112  (1 unrouted)
N$113  (1 unrouted)
N$114  (1 unrouted)
N$115  (1 unrouted)